# EAGLE design esquema_sensor (EAGLE 9.4.2)
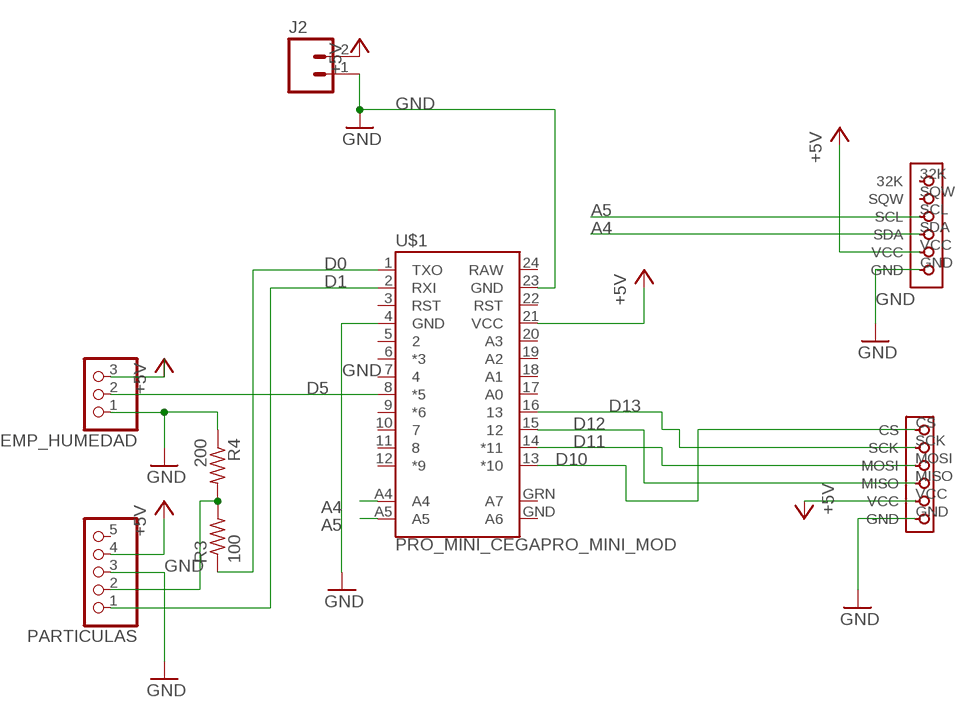
[diagram p0: schematic, sheet 1]

## Parts
J2  M025MM  [SCREWTERMINAL-5MM-2]
PARTICULAS  PINHD-1X5  [1X05]
R3  100  R-US_0207/7  [0207/7]
R4  200  R-US_0207/7  [0207/7]
RTC  DS3231_RTC  [DS3231_RTC]
SD_READER  MICRO_SD_READER  [MICRO_SD_READER]
TEMP_HUMEDAD  PINHD-1X3  [1X03]
U$1  PRO_MINI_CEGAPRO_MINI_MOD  [ARDUINO_PRO_MINI_MOD]

## Nets
+5V: J2.2 PARTICULAS.4 RTC.VCC SD_READER.VCC TEMP_HUMEDAD.3 U$1.21(VCC)
A4: RTC.SDA U$1.A4
A5: RTC.SCL U$1.A5
D0: R3.1 U$1.1(TXO)
D1: PARTICULAS.1 U$1.2(RXI)
D5: TEMP_HUMEDAD.2 U$1.8(*5)
D10: SD_READER.CS U$1.13(*10)
D11: SD_READER.MOSI U$1.14(*11)
D12: SD_READER.MISO U$1.15
D13: SD_READER.SCK U$1.16
GND: J2.1 PARTICULAS.3 R4.1 RTC.GND SD_READER.GND TEMP_HUMEDAD.1 U$1.4(GND) U$1.23(GND)
N$2: PARTICULAS.2 R3.2 R4.2
Unconnected: PARTICULAS.5 RTC.32K RTC.SQW U$1.3(RST) U$1.5 U$1.6(*3) U$1.7 U$1.9(*6) U$1.10 U$1.11 U$1.12(*9) U$1.17(A0) U$1.18(A1) U$1.19(A2) U$1.20(A3) U$1.22(RST) U$1.GND(A6) U$1.GRN(A7)

## Power pins joined to a net without a drawn wire
RAW: U$1.24(RAW)

## Library data of the parts
J2 = SparkFun-Connectors:M02: Standard 2-pin 0.1" header. Use with - straight break away headers ( PRT-00116) - right angle break away headers (PRT-00553) - swiss pins (PRT-00743) - machine pins (PRT-00117) - female headers (PRT-00115) Molex polarized connector foot print use with: PRT-08233 with associated crimp pins and housings. 2.54_SCREWTERM for use with PRT-10571. 3.5mm Screw Terminal footprints for PRT-08084 5mm Screw Terminal footprints for use with PRT-08432; STOREFRONT_ID: PRT-08432
PARTICULAS = pinhead:PINHD-1X5: PIN HEADER
R3 R4 = resistor:R-US_: RESISTOR, American symbol
RTC = fablab_uchile:DS3231_RTC
SD_READER = fablab_uchile:MICRO_SD_READER
TEMP_HUMEDAD = adafruit:PINHD-1X3: PIN HEADER
U$1 = fablab_uchile:PRO_MINI_CEGA

## Board
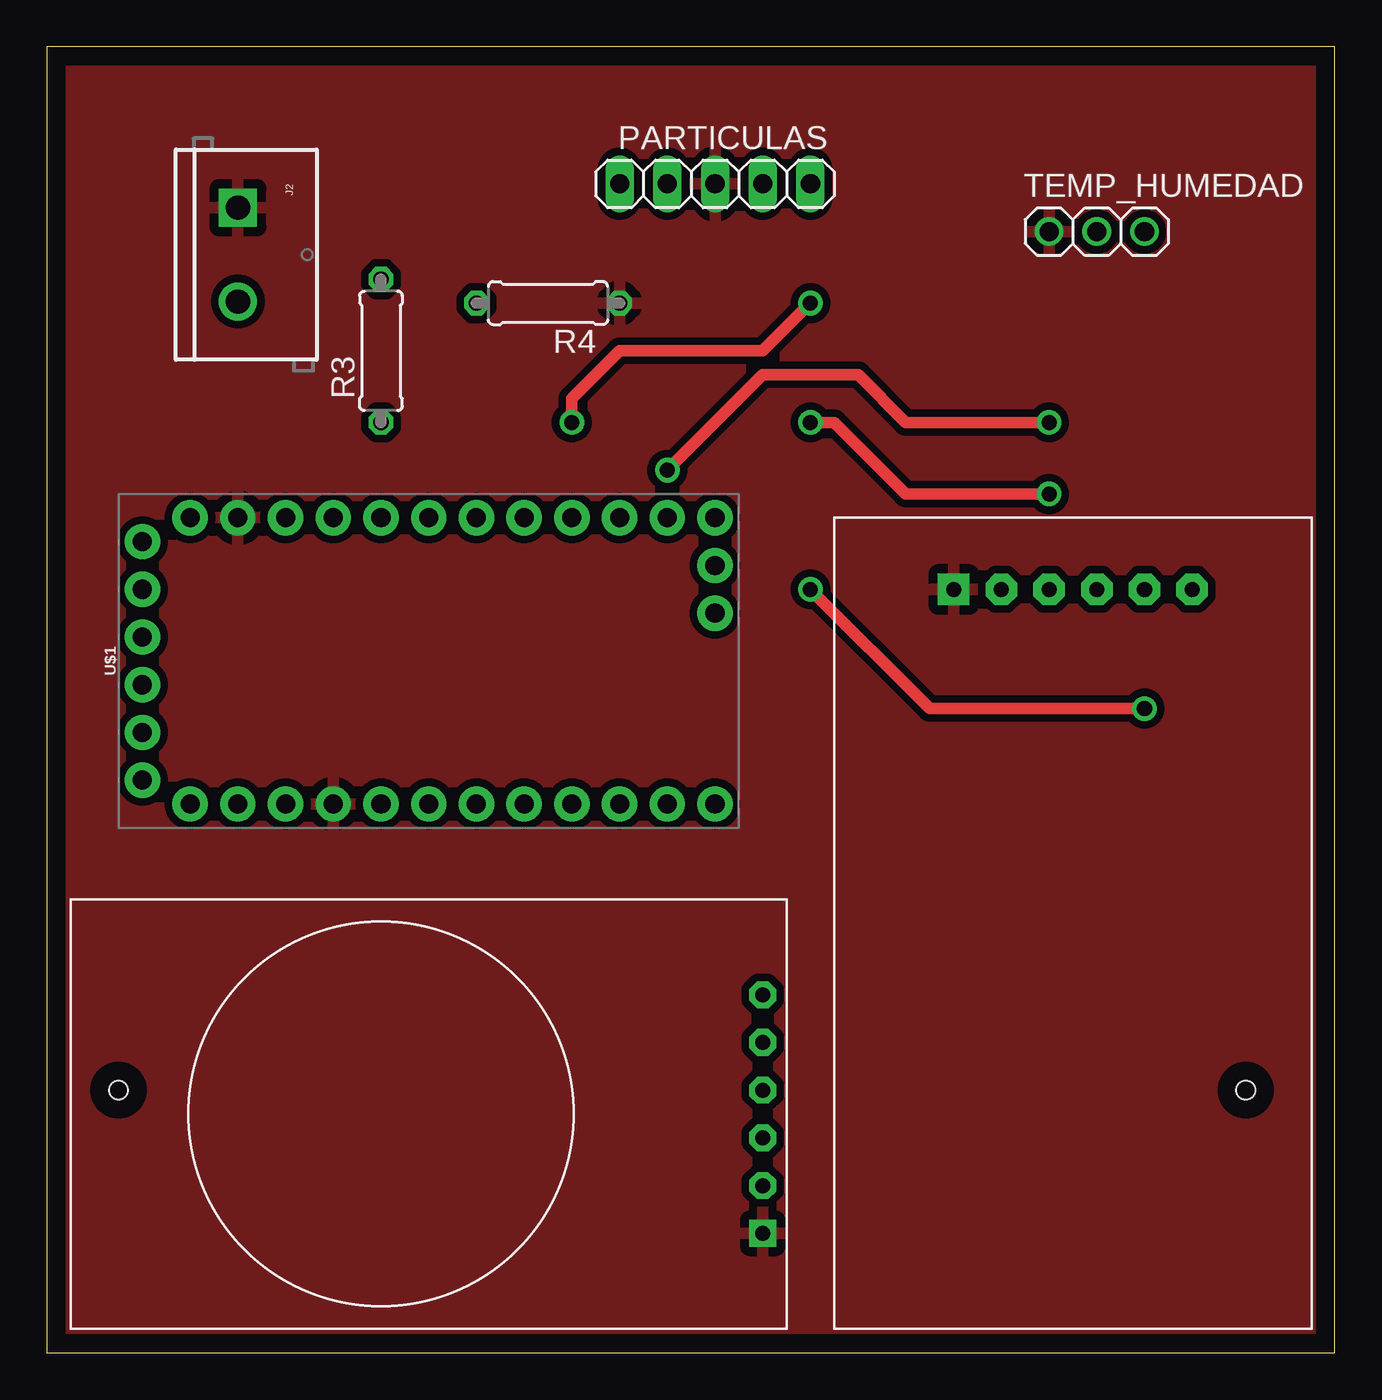
[diagram p1: board, top side]
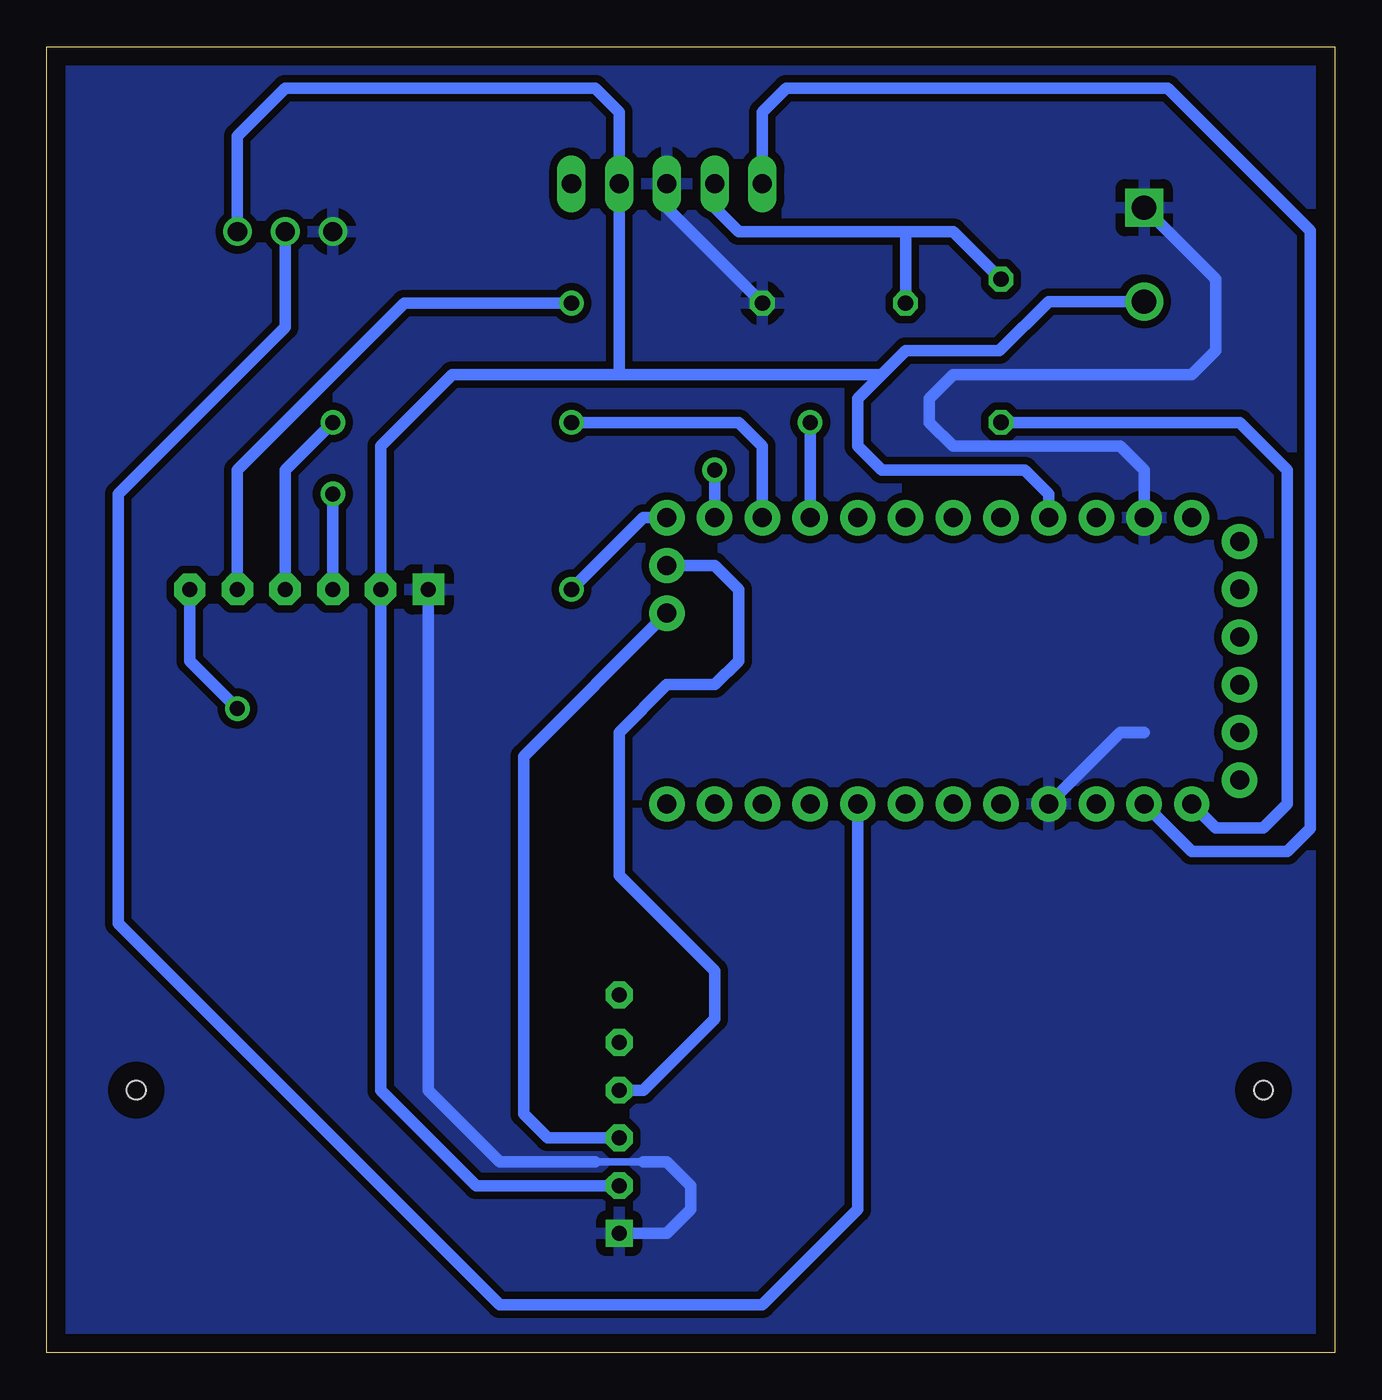
[diagram p2: board, bottom side, seen from below]

Size 68.56 x 69.52 mm. Coordinates in mm from the lower left corner, seen from the top.
Outline: 0,0 68.56,0 68.56,69.52 0,69.52 0,0
Copper layers (1*16): Top 0.035mm / dielectric 1.5mm / Bottom 0.035mm
Design rules "Fablab U. de Chile": minimum track width 0.3mm, minimum drill 0.6mm, track to track 0.3mm, track to pad 0.3mm, pad to pad 0.3mm, via to via 0.3mm, smd to smd 0.3mm, copper to edge 1mm, drill to drill 0.3mm, minimum pad ring 10mil, minimum via ring 10mil, stop-mask expansion 10mil, vias tented up to drill 0mil, thermal gap 20mil
Holes 1 mm at 3.81,13.97 63.81,13.97

### Footprints (pad centres in the part's own frame; a part is rotated, then mirrored left to right if it is on the bottom)
SCREWTERMINAL-5MM-2 = drill 1.3 pad 2.032 square: 1 0,0 | drill 1.3 pad 2.032: 2 5,0
1X05 = drill 1.016 long: 1 -5.08,0; 2 -2.54,0; 3 0,0; 4 2.54,0; 5 5.08,0
0207/7 = drill 0.813 octagon: 1 -3.81,0; 2 3.81,0
DS3231_RTC = drill 0.8 pad 1.422 octagon: 32K -6.35,10.16; SCL -1.27,10.16; SDA 1.27,10.16; SQW -3.81,10.16; VCC 3.81,10.16 | drill 0.8 pad 1.422 square: GND 6.35,10.16
MICRO_SD_READER = drill 0.8 pad 1.676 octagon: CS 6.35,11.43; MISO -1.27,11.43; MOSI 1.27,11.43; SCK 3.81,11.43; VCC -3.81,11.43 | drill 0.8 pad 1.676 square: GND -6.35,11.43
1X03 = drill 1.016: 1 -2.54,0; 2 0,0; 3 2.54,0
ARDUINO_PRO_MINI_MOD = drill 1.016 pad 1.88: 1 -7.62,12.7; 2 -7.62,10.16; 3 -7.62,7.62; 4 -7.62,5.08; 5 -7.62,2.54; 6 -7.62,0; 7 -7.62,-2.54; 8 -7.62,-5.08; 9 -7.62,-7.62; 10 -7.62,-10.16; 11 -7.62,-12.7; 12 -7.62,-15.24; 13 7.62,-15.24; 14 7.62,-12.7; 15 7.62,-10.16; 16 7.62,-7.62; 17 7.62,-5.08; 18 7.62,-2.54; 19 7.62,0; 20 7.62,2.54; 21 7.62,5.08; 22 7.62,7.62; 23 7.62,10.16; 24 7.62,12.7; A4 2.54,-15.24; A5 5.08,-15.24; BLK -6.35,15.24; GND -3.81,15.24; GRN 6.35,15.24; RXI 1.27,15.24; TXO 3.81,15.24; VCC -1.27,15.24

### Placement (x,y rotation side)
J2  10.16,60.96 270 top
PARTICULAS  35.56,62.23 0 top
R3  17.78,53.34 90 top
R4  26.67,55.88 180 top
RTC  27.94,12.7 270 top
SD_READER  54.61,29.21 0 top
TEMP_HUMEDAD  55.88,59.69 0 top
U$1  20.32,36.83 90 top

### Tracks (layer width: path | path; a pad name or v marks a point on that pad's centre or on a via)
+5V
  Bottom 0.61: RTC.VCC 45.72,8.89 50.8,13.97 SD_READER.VCC 50.8,48.26 46.99,52.07 38.1,52.07 | J2.2 15.24,55.96 17.86,53.34 22.86,53.34 24.13,52.07 | 24.13,52.07 25.4,50.8 25.4,48.26 24.13,46.99 16.51,46.99 15.24,45.72 U$1.21 | 38.1,52.07 PARTICULAS.4 38.1,66.04 39.37,67.31 55.88,67.31 58.42,64.77 TEMP_HUMEDAD.3 | 38.1,52.07 24.13,52.07
A4
  Bottom 0.61: U$1.A4 43.18,31.75 43.18,12.7 41.91,11.43 RTC.SDA
A5
  Bottom 0.61: RTC.SCL 36.83,13.97 33.02,17.78 33.02,20.32 38.1,25.4 38.1,33.02 35.56,35.56 34.29,35.56 33.02,35.56 31.75,36.83 31.75,40.64 33.02,41.91 U$1.A5
D0
  Bottom 0.61: U$1.1 6.35,27.94 3.81,27.94 2.54,29.21 2.54,46.99 5.08,49.53 R3.1
D1
  Bottom 0.61: U$1.2 7.62,26.67 2.54,26.67 1.3,27.91 1.3,59.73 8.89,67.31 29.21,67.31 30.48,66.04 PARTICULAS.1
D5
  Bottom 0.61: TEMP_HUMEDAD.2 55.88,54.61 64.77,45.72 64.77,22.86 44.45,2.54 30.48,2.54 25.4,7.62 U$1.8
D10  (via drill 0.8 pad 1.3)
  Top 0.61: v58.42,34.29 46.99,34.29 v40.64,40.64
  Bottom 0.61: SD_READER.CS 60.96,36.83 v58.42,34.29 | v40.64,40.64 36.83,44.45 U$1.13
D11  (via drill 0.8 pad 1.3)
  Top 0.61: v53.34,49.53 45.72,49.53 43.18,52.07 38.1,52.07 v33.02,46.99
  Bottom 0.61: SD_READER.MOSI 55.88,46.99 v53.34,49.53 | v33.02,46.99 U$1.14
D12  (via drill 0.8 pad 1.3)
  Top 0.61: v53.34,45.72 45.72,45.72 41.91,49.53 v40.64,49.53
  Bottom 0.61: SD_READER.MISO v53.34,45.72 | U$1.15 30.48,48.26 31.75,49.53 v40.64,49.53
D13  (via drill 0.8 pad 1.3)
  Top 0.61: v40.64,55.88 38.1,53.34 30.48,53.34 27.94,50.8 v27.94,49.53
  Bottom 0.61: SD_READER.SCK 58.42,46.99 49.53,55.88 v40.64,55.88 | v27.94,49.53 U$1.16
GND
  Bottom 0.406: 39.37,10.16 36.83,10.16
  Bottom 0.61: RTC.GND 35.56,6.35 34.29,7.62 34.29,8.89 35.56,10.16 36.83,10.16 | SD_READER.GND 48.26,13.97 44.45,10.16 39.37,10.16 | U$1.4 11.43,33.02 10.16,33.02 | J2.1 6.35,57.15 6.35,53.34 7.62,52.07 20.32,52.07 21.59,50.8 21.59,49.53 20.32,48.26 11.43,48.26 10.16,46.99 U$1.23 10.16,43.81 | R4.1 34.29,59.69 35.56,60.96
  pour Top (isolate 0.406): 0,71.12 0,0 68.58,0 68.58,71.12
  pour Bottom (isolate 0.406): 0,69.85 0,0 68.58,0 68.58,69.85
N$2
  Bottom 0.61: R3.2 20.32,59.69 22.86,59.69 | 22.86,59.69 31.75,59.69 33.02,60.96 PARTICULAS.2 | R4.2 22.86,59.69